# Altium schematic sheet CONNECTOR.SchDoc
size Letter; SheetNumber: 1; SheetTotal: 2
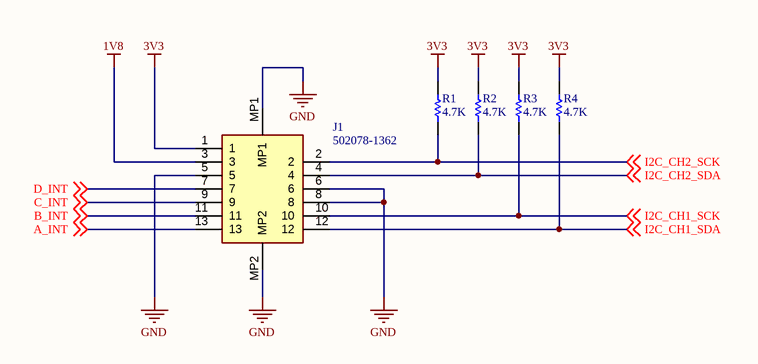
[diagram p0: CONNECTOR.SchDoc]

## Parts
J1  502078-1362  [5020781362]
R1  4.7K  [RESC1005X40X25LL05T05]
R2  4.7K  [RESC1005X40X25LL05T05]
R3  4.7K  [RESC1005X40X25LL05T05]
R4  4.7K  [RESC1005X40X25LL05T05]

## Nets
1V8: J1.3
3V3: J1.1 R1.2 R2.2 R3.2 R4.2
GND: J1.5 J1.6 J1.8 J1.MP1 J1.MP2
A_INT: J1.13 ; off-sheet A_INT
B_INT: J1.11 ; off-sheet B_INT
C_INT: J1.9 ; off-sheet C_INT
D_INT: J1.7 ; off-sheet D_INT
I2C_CH1_SCK: J1.10 R3.1 ; off-sheet I2C_CH1_SCK
I2C_CH1_SDA: J1.12 R4.1 ; off-sheet I2C_CH1_SDA
I2C_CH2_SCK: J1.2 R1.1 ; off-sheet I2C_CH2_SCK
I2C_CH2_SDA: J1.4 R2.1 ; off-sheet I2C_CH2_SDA

## Notes on the sheet
- Title
- Copyright (c) Meta Platforms, Inc. and affiliates.
  All rights reserved.
  This source code is licensed under the license found in the
  LICENSE file in the root directory of this source tree.
- Sheet
- of

## Library data of the parts
J1 = 502078-1362: Connector; Manufacturer_Name: Molex; Datasheet Link: https://www.molex.com/pdm_docs/sd/5020781362_sd.pdf; Height: 1.7mm; Manufacturer_Part_Number: 502078-1362; Mouser Part Number: 538-502078-1362; Mouser Price/Stock: https://www.mouser.co.uk/ProductDetail/Molex/502078-1362?qs=GBLSl2Akirt8csfPYHMErA%3D%3D
R1-R4 = CMP-2002-01154-4: Chip Resistor, 4.7 KOhm, +/- 1%, 0.1 W, -55 to 155 degC, 0402 (1005 Metric), RoHS, Tape and Reel; PartNumber: ERJ-2RKF4701X; Voltage Rating: 50 V; Case\/Package: 0402; Power Rating: 100 mW; Height: 0.35 mm; Mounting Technology: Surface Mount; REACH SVHC: Yes; Resistance: 4.7 KOhm; Max Operating Temperature: 155 degC; ComponentLink1Description: Manufacturer URL; ComponentLink2Description: Datasheet; Pins: 2; PackageReference: 0402; Tolerance: 1%; Case Code (Imperial): 0402; Length: 1 mm; PackageDescription: 2-Pin Surface Mount Device, Body 1 x 0.5 mm; RoHSCompliant: true; Package Quantity: 1; Radiation Hardening: No; DatasheetVersion: 04/2015; Width: 0.5 mm; Case Code (Metric): 1005; Mount: Surface Mount; ComponentLink1URL: http://www.panasonic.com/; Min Operating Temperature: -55 degC; Packaging: Cut Tape; ComponentLink2URL: http://industrial.panasonic.com/cdbs/www-data/pdf/RDA0000/AOA0000C86.pdf